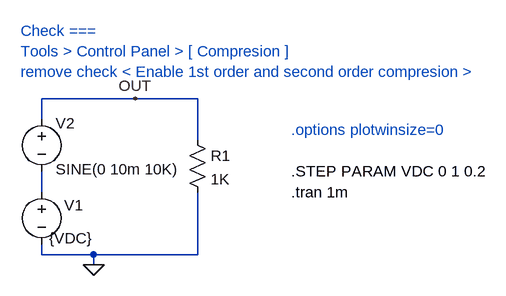
[diagram p0: schematic Fig_4-31_Data_Compression.asc]
Fig_4-31_Data_Compression.asc, the LTspice schematic file:
Version 4
SHEET 1 892 680
WIRE 224 0 80 0
WIRE 320 0 224 0
WIRE 80 32 80 0
WIRE 320 64 320 0
WIRE 80 144 80 112
WIRE 80 240 80 224
WIRE 160 240 80 240
WIRE 320 240 320 144
WIRE 320 240 160 240
WIRE 160 256 160 240
FLAG 160 256 0
FLAG 224 0 OUT
SYMBOL res 304 48 R0
SYMATTR InstName R1
SYMATTR Value 1K
SYMBOL voltage 80 128 R0
WINDOW 0 35 36 Left 2
WINDOW 3 12 87 Left 2
WINDOW 123 0 0 Left 2
WINDOW 39 0 0 Left 2
SYMATTR InstName V1
SYMATTR Value {VDC}
SYMBOL voltage 80 16 R0
WINDOW 3 22 93 Left 2
WINDOW 123 0 0 Left 2
WINDOW 39 0 0 Left 2
WINDOW 0 22 22 Left 2
SYMATTR Value SINE(0 10m 10K)
SYMATTR InstName V2
TEXT 464 144 Left 2 !.tran 1m
TEXT 464 112 Left 2 !.STEP PARAM VDC 0 1 0.2
TEXT 48 -104 Left 2 ;Check ===\nTools > Control Panel > [ Compresion ]\nremove check < Enable 1st order and second order compresion >
TEXT 464 48 Left 2 ;.options plotwinsize=0

The netlist it stands for:
* Fig_4-31_Data_Compression.asc
R1 OUT 0 1K
V1 N001 0 {VDC}
V2 OUT N001 SINE(0 10m 10K)
.tran 1m
.STEP PARAM VDC 0 1 0.2
* Check ===
* Tools > Control Panel > [ Compresion ]
* remove check < Enable 1st order and second order compresion >
* .options plotwinsize=0
.backanno
.end